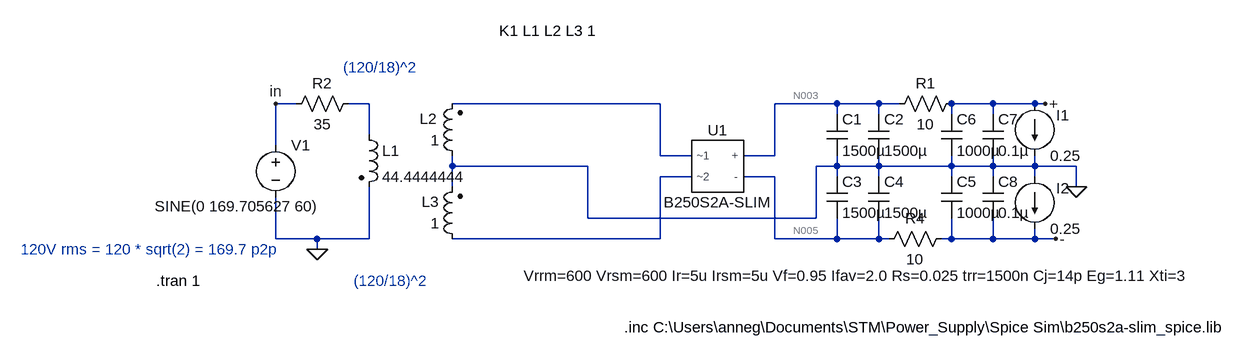
[diagram p0: schematic Draft.asc]
Draft.asc, the LTspice schematic file:
Version 4
SHEET 1 1480 680
WIRE -224 -160 -256 -160
WIRE -112 -160 -144 -160
WIRE 336 -160 16 -160
WIRE 608 -160 512 -160
WIRE 672 -160 608 -160
WIRE 704 -160 672 -160
WIRE 848 -160 784 -160
WIRE 912 -160 848 -160
WIRE 928 -160 912 -160
WIRE 608 -144 608 -160
WIRE 672 -144 672 -160
WIRE 784 -144 784 -160
WIRE 848 -144 848 -160
WIRE -112 -112 -112 -160
WIRE -256 -96 -256 -160
WIRE 336 -80 336 -160
WIRE 384 -80 336 -80
WIRE 512 -80 512 -160
WIRE 512 -80 464 -80
WIRE 16 -64 16 -80
WIRE 224 -64 16 -64
WIRE 608 -64 608 -80
WIRE 608 -64 576 -64
WIRE 672 -64 672 -80
WIRE 672 -64 608 -64
WIRE 784 -64 784 -80
WIRE 784 -64 672 -64
WIRE 848 -64 848 -80
WIRE 848 -64 784 -64
WIRE 912 -64 912 -80
WIRE 912 -64 848 -64
WIRE 976 -64 912 -64
WIRE 384 -48 336 -48
WIRE 512 -48 464 -48
WIRE 608 -48 608 -64
WIRE 672 -48 672 -64
WIRE 784 -48 784 -64
WIRE 848 -48 848 -64
WIRE 912 -48 912 -64
WIRE 16 -32 16 -64
WIRE 976 -32 976 -64
WIRE 224 16 224 -64
WIRE 576 16 576 -64
WIRE 576 16 224 16
WIRE -256 48 -256 -16
WIRE -192 48 -256 48
WIRE -112 48 -112 -32
WIRE -112 48 -192 48
WIRE 336 48 336 -48
WIRE 336 48 16 48
WIRE 512 48 512 -48
WIRE 608 48 608 16
WIRE 608 48 512 48
WIRE 672 48 672 16
WIRE 672 48 608 48
WIRE 688 48 672 48
WIRE 784 48 784 16
WIRE 784 48 768 48
WIRE 848 48 848 16
WIRE 848 48 784 48
WIRE 912 48 912 32
WIRE 912 48 848 48
WIRE 944 48 912 48
WIRE -192 64 -192 48
FLAG -256 -160 in
FLAG 928 -160 +
FLAG 944 48 -
FLAG 976 -32 0
FLAG -192 64 0
SYMBOL ind2 32 -64 R180
WINDOW 0 39 73 Left 2
WINDOW 3 36 40 Left 2
SYMATTR InstName L2
SYMATTR Value 1
SYMATTR Type ind
SYMBOL ind2 32 64 R180
WINDOW 0 36 73 Left 2
WINDOW 3 36 40 Left 2
SYMATTR InstName L3
SYMATTR Value 1
SYMATTR Type ind
SYMBOL voltage -256 -112 R0
WINDOW 3 -186 110 Left 2
WINDOW 123 0 0 Left 0
WINDOW 39 0 0 Left 0
SYMATTR Value SINE(0 169.705627 60)
SYMATTR InstName V1
SYMBOL b250s2a-slim 416 -64 R0
WINDOW 39 227 169 Center 2
SYMATTR InstName U1
SYMBOL ind2 -128 -128 R0
SYMATTR InstName L1
SYMATTR Value 44.4444444
SYMATTR Type ind
SYMATTR SpiceLine Rser=15.65
SYMBOL current 912 -160 R0
WINDOW 0 33 18 Left 2
WINDOW 123 0 0 Left 0
WINDOW 39 0 0 Left 0
SYMATTR InstName I1
SYMATTR Value 0.25
SYMBOL current 912 -48 R0
WINDOW 0 33 18 Left 2
WINDOW 123 0 0 Left 0
WINDOW 39 0 0 Left 0
SYMATTR InstName I2
SYMATTR Value 0.25
SYMBOL cap 592 -48 R0
SYMATTR InstName C3
SYMATTR Value 1500µ
SYMBOL cap 656 -48 R0
SYMATTR InstName C4
SYMATTR Value 1500µ
SYMBOL cap 768 -48 R0
SYMATTR InstName C5
SYMATTR Value 1000µ
SYMBOL cap 768 -144 R0
SYMATTR InstName C6
SYMATTR Value 1000µ
SYMBOL cap 592 -144 R0
SYMATTR InstName C1
SYMATTR Value 1500µ
SYMBOL cap 656 -144 R0
SYMATTR InstName C2
SYMATTR Value 1500µ
SYMBOL cap 832 -144 R0
SYMATTR InstName C7
SYMATTR Value 0.1µ
SYMBOL cap 832 -48 R0
SYMATTR InstName C8
SYMATTR Value 0.1µ
SYMBOL res 800 -176 R90
WINDOW 0 0 56 VBottom 2
WINDOW 3 32 56 VTop 2
SYMATTR InstName R1
SYMATTR Value 10
SYMBOL res 784 32 R90
WINDOW 0 0 56 VBottom 2
WINDOW 3 32 56 VTop 2
SYMATTR InstName R4
SYMATTR Value 10
SYMBOL res -128 -176 R90
WINDOW 0 0 56 VBottom 2
WINDOW 3 32 56 VTop 2
SYMATTR InstName R2
SYMATTR Value 35
TEXT -440 112 Left 2 !.tran 1
TEXT -136 112 Left 2 ;(120/18)^2
TEXT -152 -216 Left 2 ;(120/18)^2
TEXT 280 184 Left 2 !.inc C:\\Users\\anneg\\Documents\\STM\\Power_Supply\\Spice Sim\\b250s2a-slim_spice.lib
TEXT 88 -272 Left 2 !K1 L1 L2 L3 1
TEXT -648 64 Left 2 ;120V rms = 120 * sqrt(2) = 169.7 p2p

The netlist it stands for:
* Draft.asc
L2 0 N002 1
L3 N004 0 1
V1 in 0 SINE(0 169.705627 60)
XU1 N002 N004 N003 N005 B250S2A-SLIM Vrrm=600 Vrsm=600 Ir=5u Irsm=5u Vf=0.95 Ifav=2.0 Rs=0.025 trr=1500n Cj=14p Eg=1.11 Xti=3  ; pins ~1 ~2 + -
L1 N001 0 44.4444444 Rser=15.65
I1 + 0 0.25
I2 0 - 0.25
C3 0 N005 1500µ
C4 0 N005 1500µ
C5 0 - 1000µ
C6 + 0 1000µ
C1 N003 0 1500µ
C2 N003 0 1500µ
C7 + 0 0.1µ
C8 0 - 0.1µ
R1 + N003 10
R4 - N005 10
R2 N001 in 35
.tran 1
* (120/18)^2
* (120/18)^2
.inc C:\Users\anneg\Documents\STM\Power_Supply\Spice Sim\b250s2a-slim_spice.lib
K1 L1 L2 L3 1
* 120V rms = 120 * sqrt(2) = 169.7 p2p
.lib .\b250s2a-slim_spice.lib
.backanno
.end

* Results of the author's LTspice run, read from the files saved beside the schematic
* Operating Point, zero values left out:
*   V(n003) = -652.3 mV
*   V(n005) = 652.3 mV
*   V(+) = -3.152 V
*   V(-) = 3.152 V
*   I(I1) = 250 mA
*   I(I2) = 250 mA
*   I(R1) = -250 mA
*   I(R4) = 250 mA
*   Ix(u1:+) = -250 mA
*   Ix(u1:-) = 250 mA
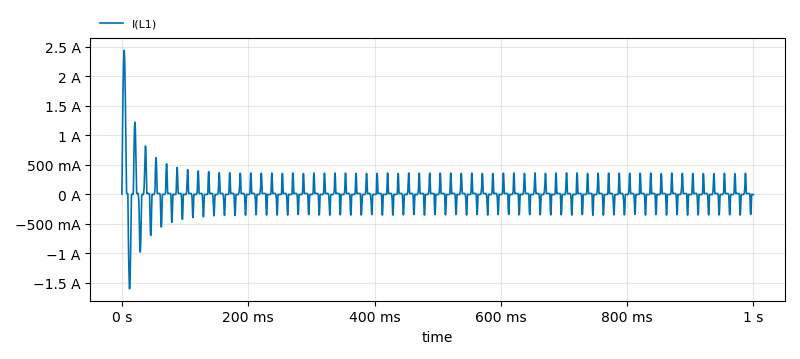
[diagram p1: Transient Analysis of Draft.asc, plotted from the saved traces]
* Transient Analysis, 1 run:
*   I(L1): min -1.607 A, max 2.436 A, average 8.083 mA, rms 240.7 mA, last -9.299 mA